# EAGLE schematic Interrupter (EAGLE 9.2.1)
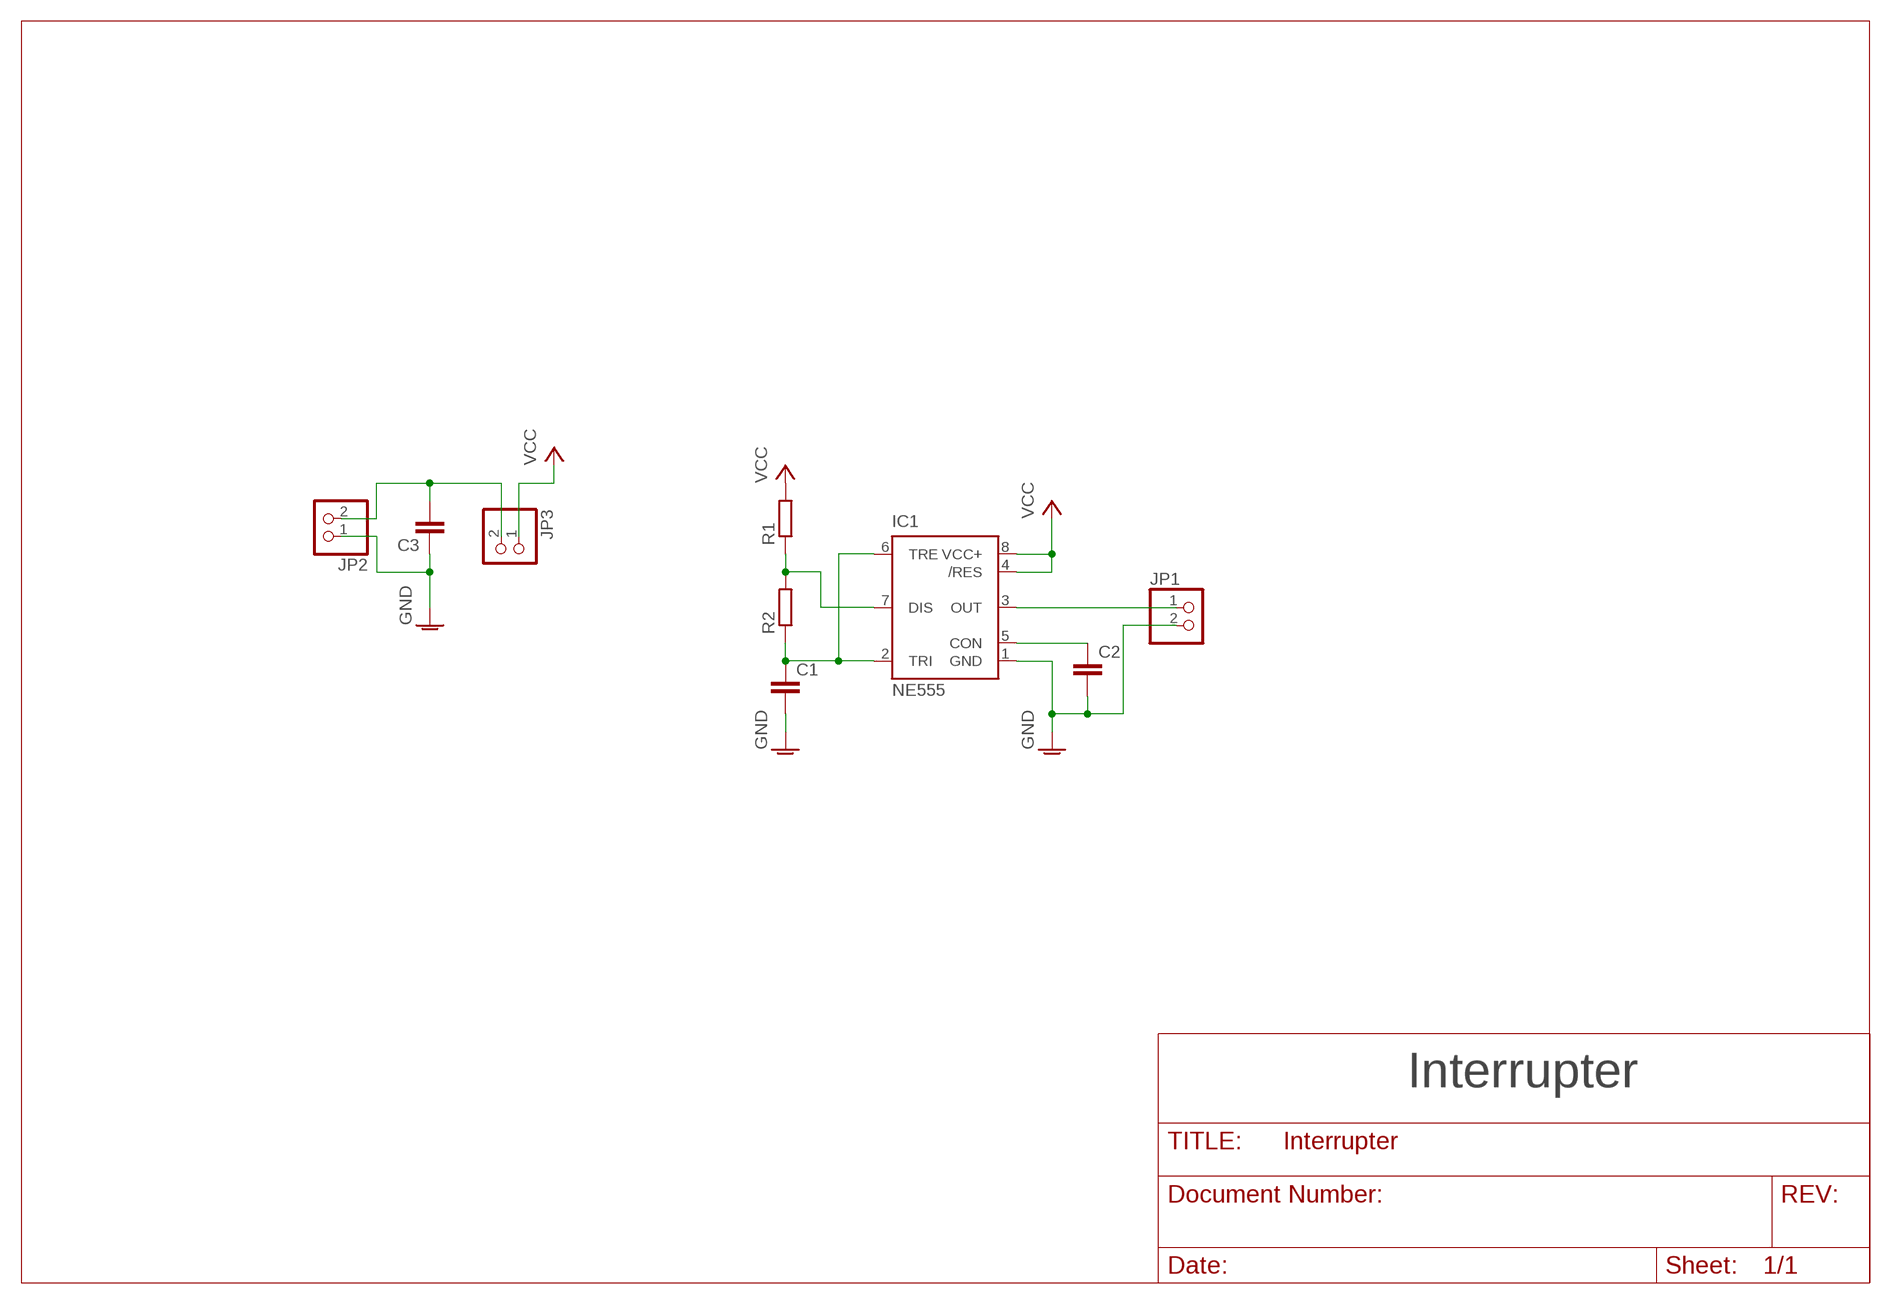
[diagram p0: schematic, sheet 1]

## Parts
C1  C-EUC0603  [C0603]
C2  C-EUC0603  [C0603]
C3  C-EUC0603  [C0603]
IC1  NE555  [DIL-08]
JP1  PINHD-1X2  [1X02]
JP2  PINHD-1X2  [1X02]
JP3  PINHD-1X2  [1X02]
R1  R-EU_R0603  [R0603]
R2  R-EU_R0603  [R0603]

## Nets
GNDA: C1.2 C2.2 C3.1 IC1.1(GND) JP1.2 JP2.1 ; supply symbol labelled GND
N$1: IC1.7(DIS) R1.1 R2.2
N$2: C1.1 IC1.2(TRI) IC1.6(TRE) R2.1
N$3: C2.1 IC1.5(CON)
N$4: C3.2 JP2.2 JP3.2
N$5: IC1.3(OUT) JP1.1
VCC: IC1.4(/RES) IC1.8(VCC+) JP3.1 R1.2

## Notes on the sheet
- Interrupter

## Library data of the parts
C1-C3 = resistor:C-EU: CAPACITOR, European symbol
IC1 = st-microelectronics:NE555: General purpose bipolar Timer; MF: Arrow Electronics; MPN: NE555N; OC_FARNELL: 1467742; OC_NEWARK: 89K1486
JP1-JP3 = pinhead:PINHD-1X2: PIN HEADER
R1 R2 = rcl:R-EU_: RESISTOR, European symbol; SPICEPREFIX: R